# Altium schematic sheet relay.SchDoc
size A4
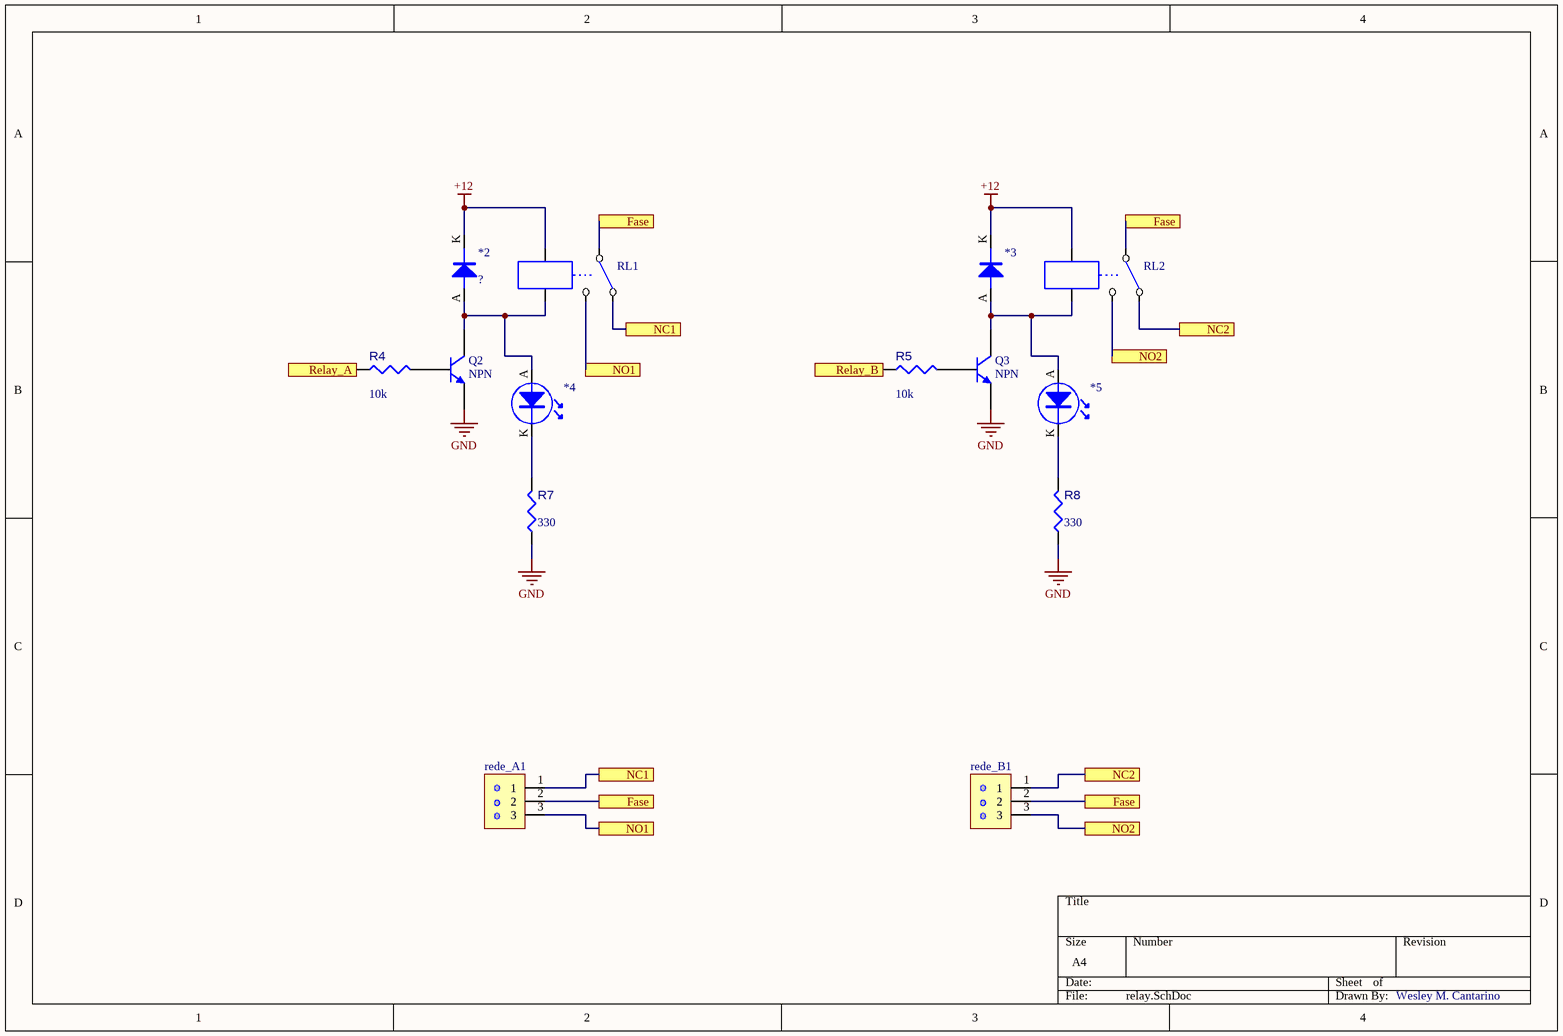
[diagram p0: relay.SchDoc]

## Parts
*2  DIO_PTH_1N4007  [DIO_PTH_DO41]  (value not drawn)
*3  DIO_PTH_1N4007  [DIO_PTH_DO41]  (value not drawn)
*4  LED_AXIAL_5MM  [HEADER_1X2]  (value not drawn)
*5  LED_AXIAL_5MM  [HEADER_1X2]  (value not drawn)
Q2  NPN  [HEADER_1X3]
Q3  NPN  [HEADER_1X3]
R4  10k  [RES_PTH_7.62MM]
R5  10k  [RES_PTH_7.62MM]
R7  330  [RES_PTH_7.62MM]
R8  330  [RES_PTH_7.62MM]
rede_A1  ?  [CN_KRE_3]  (value not drawn)
rede_B1  ?  [CN_KRE_3]  (value not drawn)
RL1  RELEICR5551  [DIV_RELE_5551]  (value not drawn)
RL2  RELEICR5551  [DIV_RELE_5551]  (value not drawn)

## Ports
Fase, NC1, NC2, NO1, NO2, Relay_A, Relay_B

## Nets
+12: *2.K *3.K RL1.4 RL2.4
GND: Q2.3(E) Q3.3(E) R7.1 R8.1
Fase: rede_A1.2 rede_B1.2 RL1.1 RL2.1 ; port Fase
NC1: rede_A1.1 RL1.2 ; port NC1
NC2: rede_B1.1 RL2.2 ; port NC2
NO1: rede_A1.3 RL1.3 ; port NO1
NO2: rede_B1.3 RL2.3 ; port NO2
Relay_A: R4.1 ; port Relay_A
Relay_B: R5.1 ; port Relay_B
Net*2_A: *2.A *4.A Q2.1(C) RL1.5
Net*3_A: *3.A *5.A Q3.1(C) RL2.5
Net*4_K: *4.K R7.2
Net*5_K: *5.K R8.2
NetQ2_2: Q2.2(B) R4.2
NetQ3_2: Q3.2(B) R5.2

## Notes on the sheet
- Wesley M. Cantarino

## Library data of the parts
*4 *5 = LED_AXIAL_5MM: pin to pad: A>1 K>2; Value: ?
Q2 Q3 = NPN: NPN Bipolar Transistor; Published: 8-Jun-2000; LatestRevisionDate: 17-Jul-2002; LatestRevisionNote: Re-released for DXP Platform.; PackageReference: TO-226-AA; Publisher: Altium Limited; PackageDescription: TO, Flat Index; 3 In-Line, Axial Leads; Body Dia. 4.8mm; Leads 0.55 x 0.51 mm (max); Code_JEDEC: TO-226-AA
R4 R5 R7 R8 = RES_PTH_7.62MM: Pin Through Hole Resistor 7.62mm
  R4 R5: Value: 10k
  R7 R8: Value: 330
rede_A1 rede_B1 = CN_MKDS_3: MKDS_3; Value: ?
*2 *3 = DIO_PTH_1N4007: Value: ?
RL1 RL2 = RELEICR5551: Value: RELEICR5551